# Altium schematic sheet tesis_page1_supply.SchDoc: Supply
size A4; Date: 01/04/2021; Author: Agustín Aon Sanchez; DrawnBy: Agustín Aon Sanchez; SheetNumber: 1; SheetTotal: 5
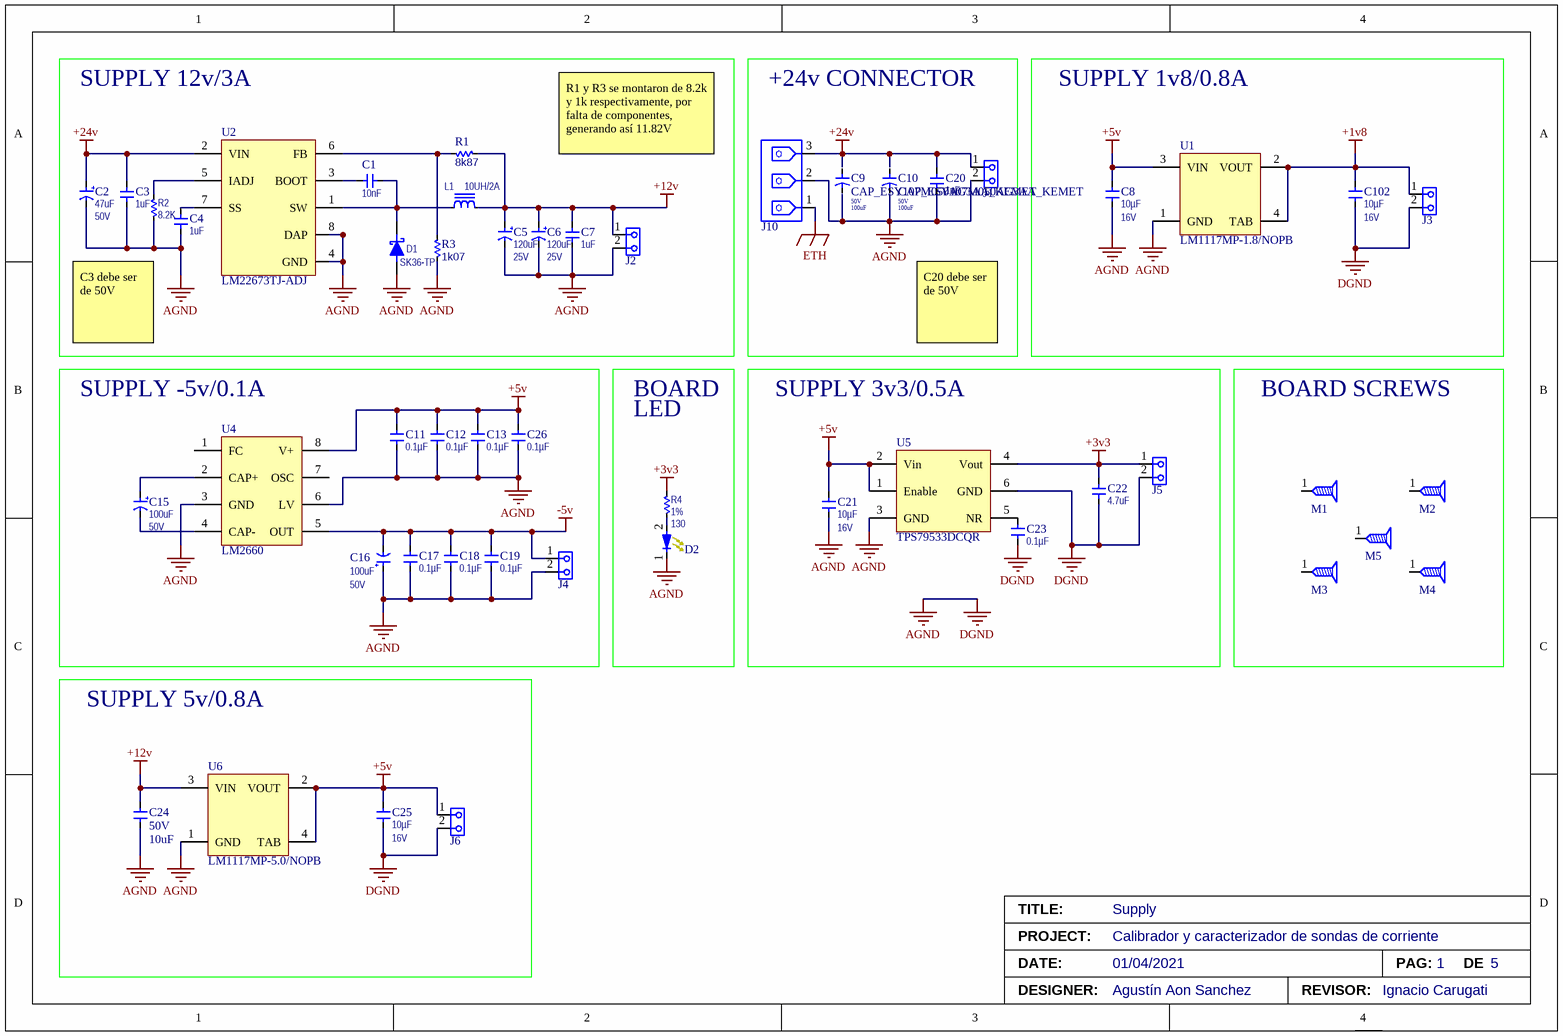
[diagram p0: tesis_page1_supply.SchDoc]

## Parts
C1  value 10nF  [CAPC3216X135N_B]  (hidden comment: CAP_C3216X7R2J103K115AA_TDK)
C2  value 47uF  Voltage Rating: 50V  [CAPAE630770X770N]  (hidden comment: CAP_EEE-1HA470XP_PANASONIC)
C3  value 1uF  [CAPC3216X135N_B]  (hidden comment: CAP_C3216X7R1E105M085AA_TDK)
C4  value 1uF  [CAPC3216X135N_B]  (hidden comment: CAP_C3216X7R1E105M085AA_TDK)
C5  value 120uF  Voltage Rating: 25V  [CAPPRD250W50D630H1250]  (hidden comment: CAP_ELXY250ELL121MF15D_UC)
C6  value 120uF  Voltage Rating: 25V  [CAPPRD250W50D630H1250]  (hidden comment: CAP_ELXY250ELL121MF15D_UC)
C7  value 1uF  [CAPC3216X135N_B]  (hidden comment: CAP_C3216X7R1E105M085AA_TDK)
C8  value 10µF  Voltage Rating: 16V  [CAPC2013X110N]  (hidden comment: CAP_CL21A106KOCL3RC)
C9  CAP_ESY107M050AG3AA_KEMET  Voltage: 50V  Capacitance: 100uF  [cap elec 8x11.5]
C10  CAP_ESY107M050AG3AA_KEMET  Voltage: 50V  Capacitance: 100uF  [cap elec 8x11.5]
C11  value 0.1µF  [CAPC2013X110N]  (hidden comment: CAP_CC0805KRX7R8BB104_YAGEO)
C12  value 0.1µF  [CAPC2013X110N]  (hidden comment: CAP_CC0805KRX7R8BB104_YAGEO)
C13  value 0.1µF  [CAPC2013X110N]  (hidden comment: CAP_CC0805KRX7R8BB104_YAGEO)
C15  value 100uF  Voltage Rating: 50V  [CAPPRD350W60D800H1200]  (hidden comment: CAP_   ESY107M050AG3AA_KEMET)
C16  value 100uF  Voltage Rating: 50V  [CAPPRD350W60D800H1200]  (hidden comment: CAP_   ESY107M050AG3AA_KEMET)
C17  value 0.1µF  [CAPC2013X110N]  (hidden comment: CAP_CC0805KRX7R8BB104_YAGEO)
C18  value 0.1µF  [CAPC2013X110N]  (hidden comment: CAP_CC0805KRX7R8BB104_YAGEO)
C19  value 0.1µF  [CAPC2013X110N]  (hidden comment: CAP_CC0805KRX7R8BB104_YAGEO)
C20  value 1uF  [CAPC3216X135N_B]
C21  value 10µF  Voltage Rating: 16V  [CAPC2013X110N]  (hidden comment: CAP_CL21A106KOCL3RC)
C22  value 4.7uF  [CAPC2013X110N]  (hidden comment: CAP_CC0805KKX5R8BB475_YAGEO_1)
C23  value 0.1µF  [CAPC2013X110N]  (hidden comment: CAP_CC0805KRX7R8BB104_YAGEO)
C24  value 10uF  Voltage Rating: 50V  [CAPC3216X135N_B]  (hidden comment: CAP_GRT31CR61H106ME01L)
C25  value 10µF  Voltage Rating: 16V  [CAPC2013X110N]  (hidden comment: CAP_CL21A106KOCL3RC)
C26  value 0.1µF  [CAPC2013X110N]  (hidden comment: CAP_CC0805KRX7R8BB104_YAGEO)
C102  value 10µF  Voltage Rating: 16V  [CAPC2013X110N]  (hidden comment: CAP_CL21A106KOCL3RC)
D1  SK36-TP  [DIOM7959X262N]
D2  DIO_150080YS75000_WURTH  [DIO0805]  (value not drawn)
J1  CON_Header_1x2  [RAD2]  (value not drawn)
J2  CON_Header_1x2  [RAD2]  (value not drawn)
J3  CON_Header_1x2  [RAD2]  (value not drawn)
J4  CON_Header_1x2  [RAD2]  (value not drawn)
J5  CON_Header_1x2  [RAD2]  (value not drawn)
J6  CON_Header_1x2  [RAD2]  (value not drawn)
J10  CON_691137710003  [CON_691137710003]  (value not drawn)
L1  value 10UH/2A  [MAG_INDUCTOR2A]  (hidden comment: MAG_SRR1005-100M_BOURNS)
M1  MSC_SCREW  [MH320]  (value not drawn)  (no BOM)
M2  MSC_SCREW  [MH320]  (value not drawn)  (no BOM)
M3  MSC_SCREW  [MH320]  (value not drawn)  (no BOM)
M4  MSC_SCREW  [MH320]  (value not drawn)  (no BOM)
M5  MSC_SCREW  [MH320]  (value not drawn)  (no BOM)
R1  value 8k87  [RESC2013X065BN]  (hidden comment: RES_RC0805FR-078K87L)
R2  value 8.2K  [RESC3216N]  (hidden comment: RES_ERJ-8GEYJ822V_Panasonic)
R3  value 1k07  [RESC2013X065BN]  (hidden comment: RES_RC0805FR-071K07L)
R4  value 130  Tolerance: 1%  [RESC2013X065BN]  (hidden comment: RES_RC0805FR-07130RL_YAGEO)
U1  LM1117MP-1.8/NOPB  [SOT223-3L]
U2  LM22673TJ-ADJ  [TJ7A_N]
U4  LM2660  [SOIC127P600-8BN]
U5  TPS79533DCQR  [SOT223-6L]
U6  LM1117MP-5.0/NOPB  [SOT223-3L]

## Blocks framed on the sheet
SUPPLY 12v/3A: C1-C7 D1 J2 L1 R1-R3 U2
+24v CONNECTOR: C9 C10 C20 J1 J10
SUPPLY 1v8/0.8A: C8 C102 J3 U1
SUPPLY -5v/0.1A: C11-C13 C15-C19 C26 J4 U4
SUPPLY 3v3/0.5A: C21-C23 J5 U5
BOARD SCREWS: M1-M5
SUPPLY 5v/0.8A: C24 C25 J6 U6

## Nets
+1v8: C102.1(T1) J3.1 U1.2(VOUT) U1.4(TAB)
+3v3: C22.1(T1) J5.1 R4.2(T2) U5.4(Vout)
+5v: C8.1(T1) C11.1(T1) C12.1(T1) C13.1(T1) C21.1(T1) C25.1(T1) C26.1(T1) J6.1 U1.3(VIN) U4.8(V+) U5.1(Enable) U5.2(Vin) U6.2(VOUT) U6.4(TAB)
+12v: C5.1 C6.1 C7.1(T1) C24.1(T1) J2.1 L1.2 R1.1(T1) U6.3(VIN)
+24v: C2.1 C3.1(T1) C20.1(T1) J1.1 J10.3 U2.2(VIN)
-5v: C16.2 C17.1(T1) C18.1(T1) C19.1(T1) J4.1 U4.5(OUT)
AGND: C2.2 C3.2(T2) C4.2(T2) C5.2 C6.2 C7.2(T2) C8.2(T2) C11.2(T2) C12.2(T2) C13.2(T2) C16.1 C17.2(T2) C18.2(T2) C19.2(T2) C20.2(T2) C21.2(T2) C22.2(T2) C23.2(T2) C24.2(T2) C25.2(T2) C26.2(T2) C102.2(T2) D1.2(A) D2.1(Cathode) J1.2 J2.2 J3.2 J4.2 J5.2 J6.2 J10.2 R2.1(T1) R3.1(T1) U1.1(GND) U2.4(GND) U2.8(DAP) U4.3(GND) U4.6(LV) U5.3(GND) U5.6(GND) U6.1(GND)  [also labelled DGND]
ETH: J10.1
NetC1_1: C1.1(T1) U2.3(BOOT)
NetC1_2: C1.2(T2) D1.1(K) L1.1 U2.1(SW)
NetC4_1: C4.1(T1) U2.7(SS)
NetC15_1: C15.1 U4.2(CAP+)
NetC15_2: C15.2 U4.4(CAP-)
NetC23_1: C23.1(T1) U5.5(NR)
NetD2_2: D2.2(Anode) R4.1(T1)
NetR1_2: R1.2(T2) R3.2(T2) U2.6(FB)
NetR2_2: R2.2(T2) U2.5(IADJ)

Not connected (* = marked no-connect by the designer): C9 24 25; C10 24 25; M1 1; M2 1; M3 1; M4 1; M5 1; U4 1(FC) 7(OSC)

## Notes on the sheet
- R1 y R3 se montaron de 8.2k y 1k respectivamente, por falta de componentes, generando así 11.82V
- C3 debe ser de 50V
- C20 debe ser de 50V
- BOARD
- LED
- TITLE:
- PROJECT:
- DATE:
- DESIGNER:
- Calibrador y caracterizador de sondas de corriente
- 01/04/2021
- Agustín Aon Sanchez
- REVISOR:
- Ignacio Carugati
- PAG:
- DE

## Library data of the parts
C1 = CAP_C3216X7R2J103K115AA_TDK: 10000pF, 630 V, Capacitores cerámicos, X7R, 1206 (3216 métrico), 0.126" L x 0.063" A (3.20 mm x 1.60 mm); Manufacturer: TDK; Tolerance: 10%; Voltage Rating: 630 V; Supplier: *; Supplier Part No: *; Power Rating: *; BOM Populate: *; Digikey Part Number: 445-2291-1-ND; Mouser Part Number: 810-C3216X7R2J103K; Manufacturer Part Number: C3216X7R2J103K115AA
C2 = CAP_EEE-1HA470XP_PANASONIC: 47µF 50V Aluminum Capacitors Radial, Can - SMD 2000 Hrs @ 85°C; Tolerance: 20%; BOM Populate: *; Power Rating: *; Supplier Part No: *; Supplier: *; Manufacturer: Panasonic; Petra Part No: *; Digikey Part Number: PCE3929CT-ND; Mouser Part Number: 667-EEE-1HA470XP; Manufacturer Part Number: EEE-1HA470XP
C3 C4 C7 C20 = CAP_C3216X7R1E105M085AA_TDK: 1 µF, 25 V, Capacitores cerámicos, X7R, 1206 (3216 métrico), 0.126" L x 0.063" A (3.20 mm x 1.60 mm); Manufacturer: TDK; Tolerance: 20%; Voltage Rating: 25V; Supplier: *; Supplier Part No: *; Power Rating: *; BOM Populate: *; Digikey Part Number: 445-4024-1-ND; Mouser Part Number: 810-C3216X7R1E105M-2; Manufacturer Part Number: C3216X7R1E105M085AA
C5 C6 = CAP_ELXY250ELL121MF15D_UC: CAP ALUM 120UF 20% 25V RADIAL; BOM Populate: *; Power Rating: *; Supplier Part No: *; Supplier: *; Digikey Part Number: 565-1791-ND; Tolerance: 20%; Petra Part No: *; Mouser Part Number: 661-ELXY250ELL121MF1; Manufacturer Part Number: ELXY250ELL121MF15D
C8 C21 C25 C102 = CAP_CL21A106KOCL3RC: CAP CER 10UF 16V X5R 0805; Manufacturer: Samsung; Tolerance: 10%; Manufacturer Part Number: CL21A106KOCL3RC; Supplier 1: Future Electronics; RoHS: Yes; Category: Ceramic Capacitors; Stock 1: 3934; Pricing 1: 1=0,10400, 50=0,08230, 100=0,07900, 500=0,07190, 1500=0,06740 (USD); Mount: Surface Mount; Case/Package: 0805; Case Code (Metric): 2012; Case Code (Imperial): 0805; Min Operating Temperature: -55°C; Max Operating Temperature: 85°C; Package Quantity: 1; Packaging: Tape and Reel; Length: 0.079inch; Width: 0.049inch; Thickness: 0.037inch; ComponentLink1URL: https://datasheet.ciiva.com/25796/cl21a106kocl3rc-25796224.pdf?src-supplier=Digi-Key; ComponentLink1Description: https://datasheet.ciiva.com/25796/cl21a106kocl3rc-25796224.pdf?src-supplier=Digi-Key; Supplier Part Number 1: 8109145; Capacitance: 10µF
C9 C10 = CAP_ESY107M050AG3AA_KEMET: KEMET - ESY107M050AG3AA - Elektrolytkondensator, 100 µF, 50 V, Produktreihe ESY, ± 20%, Radial bedrahtet, 8 mm; Dielectric Material: Aluminium; Ripple Current: 511mA; Life (Hours): 3000Hour; Leakage Current: 50uA; Dissipation Factor: 0.1%; Lead/Base Style: Straight; Impedance: 74mR; Lead Diameter: 0.6mm; Lead Length: 20mm; Tolerance: 20%; Voltage Rating: 50V; Supplier 1: Digi-Key; Manufacturer 1: KEMET; Manufacturer Part Number 1: ESY107M050AG3AA; Stock 1: 587; Pricing 1: 1=0,44000, 10=0,30700, 50=0,21500, 100=0,18420, 500=0,13818, 1000=0,11668, 2500=0,11054, 5000=0,10440 (USD); RoHS: Yes; Mount: Through Hole,PCB; Case/Package: Radial; Min Operating Temperature: -40°C; Max Operating Temperature: 105°C; Termination: Radial; Packaging: Bulk; Voltage Rating (DC): 50V; Package Quantity: 6000; Series: ESY; ESR (Equivalent Series Resistance): 74mR; Diameter: 8mm; Length: 11mm; Height: 11mm; Lead Pitch: 3.5mm; Height - Seated (Max): 0.492inch; Radiation Hardening: No; RoHS Compliant: Yes; ComponentLink1URL: http://www.farnell.com/datasheets/2751412.pdf?src-supplier=Farnell; ComponentLink1Description: http://www.farnell.com/datasheets/2751412.pdf?src-supplier=Farnell; ComponentLink2URL: http://www.mouser.com/ds/2/212/KEM_A4007_ESY-1103537.pdf?src-supplier=Mouser; ComponentLink2Description: http://www.mouser.com/ds/2/212/KEM_A4007_ESY-1103537.pdf?src-supplier=Mouser; ComponentLink3URL: http://components.arrow.com/part/dataview/0323_06946698?src-supplier=Arrow+Europe; ComponentLink3Description: http://components.arrow.com/part/dataview/0323_06946698?src-supplier=Arrow+Europe; ComponentLink4URL: https://www.alliedelec.com/m/d/2f7883d23207e2a46fd2b27bea013c02.pdf?src-supplier=Allied+Electronics; ComponentLink4Description: https://www.alliedelec.com/m/d/2f7883d23207e2a46fd2b27bea013c02.pdf?src-supplier=Allied+Electronics; ComponentLink5URL: http://uk.rs-online.com/webdocs/13da/0900766b813da6ab.pdf?src-supplier=RSComponents; ComponentLink5Description: http://uk.rs-online.com/webdocs/13da/0900766b813da6ab.pdf?src-supplier=RSComponents; ComponentLink6URL: https://api.kemet.com/component-edge/download/specsheet/ESY107M050AG3AA.pdf?src-supplier=Digi-Key; ComponentLink6Description: https://api.kemet.com/component-edge/download/specsheet/ESY107M050AG3AA.pdf?src-supplier=Digi-Key; ComponentLink7URL: http://capacitoredge.kemet.com/capedge2/DataSheet?pn=ESY107M050AG3AA&src-supplier=Avnet; ComponentLink7Description: http://capacitoredge.kemet.com/capedge2/DataSheet?pn=ESY107M050AG3AA&src-supplier=Avnet; ComponentLink8URL: http://capacitoredge.kemet.com/capedge2/DataSheet/Datasheet-ESY107M050AG3AA.pdf?pn=ESY107M050AG3AA&src-supplier=Onlinecomponents.com; ComponentLink8Description: http://capacitoredge.kemet.com/capedge2/DataSheet/Datasheet-ESY107M050AG3AA.pdf?pn=ESY107M050AG3AA&src-supplier=Onlinecomponents.com; ComponentLink9URL: http://capacitoredge.kemet.com/capedge2/DataSheet?pn=ESY107M050AG3AA&src-supplier=Avnet+Europe; ComponentLink9Description: http://capacitoredge.kemet.com/capedge2/DataSheet?pn=ESY107M050AG3AA&src-supplier=Avnet+Europe; ComponentLink10URL: http://www.farnell.com/datasheets/2751412.pdf?src-supplier=Newark; ComponentLink10Description: http://www.farnell.com/datasheets/2751412.pdf?src-supplier=Newark; Supplier Part Number 1: 399-6119-ND
C11-C13 C17-C19 C23 C26 = CAP_CC0805KRX7R8BB104_YAGEO: CAP CER 0.1UF 25V 10% X7R 0805; Manufacturer: Yageo; Digikey Part Number: 311-1141-1-ND; Supplier: *; Tolerance: 10%; Power Rating: *; Voltage Rating: 25V; BOM Populate: *; Mouser Part Number: 603-CC805KRX7R8BB104; Manufacturer Part Number: CC0805KRX7R8BB104
C15 C16 = CAP_   ESY107M050AG3AA_KEMET: CAP ALUM 100UF 20% 50V RADIAL; BOM Populate: *; Power Rating: *; Supplier Part No: *; Supplier: *; Digikey Part Number: 399-6119-ND; Tolerance: 20%; Petra Part No: *; Mouser Part Number: 80-ESY107M050AG3AA; Manufacturer Part Number: ESY107M050AG3AA
C22 = CAP_CC0805KKX5R8BB475_YAGEO_1: CAP CER 4.7UF 25V X5R 0805; Manufacturer: YAGEO; Tolerance: 10%; Voltage Rating: 25V; Digikey Part Number: 311-1904-1-ND; Mouser Part Number: 603-CC805KKX5R8BB475; Manufacturer Part Number: CC0805KKX5R8BB475
C24 = CAP_GRT31CR61H106ME01L: Cap Ceramic 10uF 50V X5R 20% Pad SMD 1206 85C Automotive T/R; Manufacturer: Murata; Tolerance: 20%; Manufacturer Part Number: GRT31CR61H106ME01L; Supplier 1: Digi-Key; RoHS: Yes; Category: Ceramic Capacitors; Stock 1: 575627; Pricing 1: 1=0,46000, 10=0,31800, 50=0,22240, 100=0,19060, 500=0,14294, 1000=0,12070 (USD); Mount: Surface Mount; Case/Package: 1206; Case Code (Metric): 3216; Case Code (Imperial): 1206; Min Operating Temperature: -55°C; Max Operating Temperature: 85°C; Packaging: Tape and Reel; Length: 0.126inch; Width: 0.063inch; Thickness: 0.071inch; ComponentLink1URL: http://search.murata.co.jp/Ceramy/image/img/A01X/G101/ENG/GRT31CR61H106ME01-01.pdf?src-supplier=Digi-Key; ComponentLink1Description: http://search.murata.co.jp/Ceramy/image/img/A01X/G101/ENG/GRT31CR61H106ME01-01.pdf?src-supplier=Digi-Key; Supplier Part Number 1: 490-12457-1-ND; Ratings: AEC-Q200; RoHS Compliant: Yes
D1 = DIO_SK36_MICROCOM: DIODE SCHOTTKY 60V 3A SMC; Manufacturer: Micro Commercial Co; Digikey Part Number: SK36-TPMSCT-ND; Manufacturer Part Number: SK36-TP; Mouser Part Number: 833-SK36-TP
D2 = DIO_150080YS75000_WURTH: LED YELLOW CLEAR 0805 SMD; Manufacturer: Wurth Electronics Inc.; Manufacturer Part Number: 150080YS75000; Digikey Part Number: 732-4987-1-ND; Mouser Part Number: 710-150080YS75000
J10 = CON_691137710003: TERM BLK 3POS SIDE ENTRY 5MM PCB; Manufacturer: Wurth Electronics; Supplier 1: Digi-Key; Supplier Part Number 1: 732-10956-ND; Manufacturer Part Number: 691137710003; RoHS: No; Stock 1: 910; Pricing 1: 1=0,62000, 10=0,55000, 50=0,49000, 100=0,44000, 500=0,42000 (USD); ComponentLink1URL: https://katalog.we-online.de/em/datasheet/691137710003.pdf?src-supplier=Digi-Key; ComponentLink1Description: https://katalog.we-online.de/em/datasheet/691137710003.pdf?src-supplier=Digi-Key
L1 = MAG_SRR1005-100M_BOURNS: FIXED IND 10UH 2A 65 MOHM SMD; Manufacturer: Bourns Inc; BOM Populate: *; Current Rating: *; Supplier: *; Supplier Part No: *; Voltage Rating: *; Tolerance: *; Digikey Part Number: SRR1005-100MCT-ND; Manufacturer Part Number: SRR1005-100M; Mouser Part Number: 652-SRR1005-100M
M1-M5 = MSC_SCREW: SCREW; BOM Populate: *; Tolerance: *; Power Rating: *; Voltage Rating: *
R1 = RES_RC0805FR-078K87L: Res Thick Film 0805 8.87K Ohm 1% 0.125W(1/8W) ±100ppm/C Epoxy Pad SMD T/R; Manufacturer: Yageo; Temperature Coefficient: 100ppm/°C; Power Rating: 125mW; Voltage Rating: 150V; Supplier 1: Digi-Key; Supplier Part Number 1: 311-8.87KCRCT-ND; Manufacturer Part Number: RC0805FR-078K87L; Category: Chip SMD Resistors; Case/Package: 0805; Contact Plating: Tin,Lead,Matte; Case Code (Metric): 2012; Case Code (Imperial): 0805; Size Code: 0805; Min Operating Temperature: -55°C; Max Operating Temperature: 155°C; Tolerance: 1%; Resistor Type: Thick Film; Package Quantity: 1; Packaging: Tape and Reel; Number of Terminations: 2; Termination: SMD/SMT; Max Power Dissipation: 125mW; Voltage Rating (DC): 150V; Features: Moisture Resistant; Series: RC; Construction: Rectangular; Length: 2mm; Width: 0.049inch; Height: 0.024inch; Depth: 1.25mm; Radiation Hardening: No; Military Standard: Not; Lead Free: Lead Free; RoHS Compliant: Yes; ComponentLink1URL: https://datasheet.ciiva.com/17423/rc0805-17423031.pdf?src-supplier=Future+Electronics; ComponentLink1Description: https://datasheet.ciiva.com/17423/rc0805-17423031.pdf?src-supplier=Future+Electronics; ComponentLink2URL: https://datasheet.ciiva.com/2491/pyu-r-int-thick-7-2491576.pdf?src-supplier=Digi-Key; ComponentLink2Description: https://datasheet.ciiva.com/2491/pyu-r-int-thick-7-2491576.pdf?src-supplier=Digi-Key; ComponentLink3URL: https://datasheet.ciiva.com/2491/pyu-r-int-thick-7-2491577.pdf?src-supplier=Digi-Key; ComponentLink3Description: https://datasheet.ciiva.com/2491/pyu-r-int-thick-7-2491577.pdf?src-supplier=Digi-Key; ComponentLink4URL: https://datasheet.ciiva.com/2491/pyu-r-int-thick-7-2491578.pdf?src-supplier=Digi-Key; ComponentLink4Description: https://datasheet.ciiva.com/2491/pyu-r-int-thick-7-2491578.pdf?src-supplier=Digi-Key
R2 = RES_ERJ-8GEYJ822V_Panasonic: RES SMD 8.2K OHM 5% 1/4W 1206; BOM Populate: *; Supplier Part No: *; Supplier: *; Tolerance: 5%; Manufacturer: Panasonic; Digikey Part Number: P8.2KECT-ND; Power Rating: 1/4W; Manufacturer Part Number: ERJ-8GEYJ822V; Mouser Part Number: 667-ERJ-8GEYJ822V
R3 = RES_RC0805FR-071K07L: Res Thick Film 0805 1.07K Ohm 1% 1/8W 100ppm/C Molded SMD Paper T/R; Manufacturer: Yageo; Resistance: 1.07kR; Temperature Coefficient: 100ppm/°C; Power Rating: 125mW; Voltage Rating: 150V; Supplier 1: Digi-Key; Manufacturer Part Number: RC0805FR-071K07L; RoHS: Yes; Category: Chip SMD Resistors; Stock 1: 47079; Pricing 1: 1=0,10000, 10=0,04000, 100=0,01620, 1000=0,00726, 2500=0,00630 (USD); Case/Package: 0805; Contact Plating: Tin,Matte; Case Code (Imperial): 0805; Case Code (Metric): 2012; Size Code: 0805; Min Operating Temperature: -55°C; Max Operating Temperature: 155°C; Tolerance: 1%; Resistor Type: Thick Film; Packaging: Tape and Reel; Package Quantity: 1; Termination: SMD/SMT; Number of Terminations: 2; Max Power Dissipation: 125mW; Voltage Rating (DC): 150V; Features: Moisture Resistant; Series: RC; Construction: Rectangular; Length: 2mm; Width: 1.25mm; Height: 0.024inch; Depth: 1.25mm; Military Standard: Not; Lead Free: Lead Free; RoHS Compliant: Yes; ComponentLink1URL: https://datasheet.ciiva.com/17054/rc0805-17054582.pdf?src-supplier=Future+Electronics; ComponentLink1Description: https://datasheet.ciiva.com/17054/rc0805-17054582.pdf?src-supplier=Future+Electronics; ComponentLink2URL: https://datasheet.ciiva.com/2491/pyu-r-int-thick-7-2491690.pdf?src-supplier=Digi-Key; ComponentLink2Description: https://datasheet.ciiva.com/2491/pyu-r-int-thick-7-2491690.pdf?src-supplier=Digi-Key; ComponentLink3URL: https://datasheet.ciiva.com/2491/pyu-r-int-thick-7-2491691.pdf?src-supplier=Digi-Key; ComponentLink3Description: https://datasheet.ciiva.com/2491/pyu-r-int-thick-7-2491691.pdf?src-supplier=Digi-Key; ComponentLink4URL: https://datasheet.ciiva.com/2491/pyu-r-int-thick-7-2491692.pdf?src-supplier=Digi-Key; ComponentLink4Description: https://datasheet.ciiva.com/2491/pyu-r-int-thick-7-2491692.pdf?src-supplier=Digi-Key; Supplier Part Number 1: 311-1.07KCRCT-ND
R4 = RES_RC0805FR-07130RL_YAGEO: RES SMD 130 OHM 1% 1/8W 0805; Manufacturer: Yageo; BOM Populate: *; Supplier Part No: *; Supplier: *; Digikey Part Number: 311-130CRCT-ND; Power Rating: 1/8W; Manufacturer Part Number: RC0805FR-07130RL; Mouser Part Number: 603-RC0805FR-07130RL
U1 = IC_LM1117MP-1.8/NOPB: IC REG LDO 1.8V .8A SOT-223-4; Manufacturer: TI National Semiconductor; Number of Terminals/Pins: 4; Number of Outputs: 1; Max Input Voltage: 15V; Max Output Current: 800mA; Polarity: Positive; Quiescent Current: 10mA; Accuracy: 1%; Output Type: Fixed; Dropout Voltage: 1.2V; Min Input Voltage: 2.6V; Current Rating: 800A; Supplier 1: Digi-Key; Manufacturer Part Number: LM1117MP-1.8/NOPB; RoHS: Yes; Category: Voltage Regulators - Linear; Stock 1: 6695; Pricing 1: 1=1,10000, 10=0,98500, 25=0,93520, 100=0,71810, 250=0,63460, 500=0,60120 (USD); Mount: Surface Mount; Case/Package: SOT-223; Number of Pins: 4; Min Operating Temperature: 0°C; Max Operating Temperature: 125°C; Output Voltage: 1.8V; Output Current: 800mA; Packaging: Tape and Reel; Nominal Output Voltage: 1.8V; Output Voltage Accuracy: 1%; Package Quantity: 1000; Length: 6.5mm; Width: 3.56mm; Height: 1.6mm; Radiation Hardening: No; REACH SVHC: No SVHC; Lead Free: Lead Free; Supplier Part Number 1: LM1117MP-1.8/NOPBCT-ND
U2 = IC_LM22673TJ-ADJ: 3A SIMPLE SWITCHER® Step-Down Voltage Regulator with Adjustable Soft-Start and Current Limit, 7-pin TO-263 Thin; Manufacturer Part Number: LM22673TJ-ADJ/NOPB; Digikey Part Number: LM22673TJ-ADJ/NOPBCT-ND; Mouser Part Number: 926-LM22673TJADJNOPB
U4 = IC_LM2660MX/NOPB_1: IC REG SWTCHD CAP INV 0.1A 8SOIC; Digikey Part Number: LM2660MX/NOPBCT-ND; Manufacturer Part Number: LM2660MX/NOPB; Mouser Part Number: 926-LM2660MX/NOPB
U5 = IC_TPS79533DCQR_TI: IC REG LIN 3.3V 500MA SOT223-6; Manufacturer Part Number: 595-TPS79533DCQR; Digikey Part Number: 296-13810-1-ND; Mouser Part Number: TPS79533DCQR
U6 = IC_LM1117MP-5.0/NOPB: IC REG LDO 5V .8A SOT-223-4; Manufacturer: TI National Semiconductor; Number of Outputs: 1; Max Input Voltage: 15V; Max Output Current: 800mA; Polarity: Positive; Quiescent Current: 5mA; Accuracy: 1%; Output Type: Fixed; Dropout Voltage: 1.2V; Min Input Voltage: 2.6V; Current Rating: 800A; Max Supply Voltage: 12V; Max Supply Current: 10mA; Power Supply Rejection Ratio (PSRR): 75dB; Supplier 1: Digi-Key; Manufacturer Part Number: LM1117MP-5.0/NOPB; RoHS: Yes; Category: Voltage Regulators - Linear; Stock 1: 1093; Pricing 1: 1=1,17000, 10=1,04400, 25=0,99120, 100=0,76120, 250=0,67268, 500=0,63728 (USD); Mount: Surface Mount; Case/Package: SOT-223; Number of Pins: 4; Min Operating Temperature: 0°C; Max Operating Temperature: 125°C; Output Voltage: 5V; Output Current: 800mA; Packaging: Tape and Reel; Nominal Output Voltage: 5V; Output Voltage Accuracy: 1%; Package Quantity: 1000; Length: 6.5mm; Width: 3.56mm; Height: 1.6mm; Radiation Hardening: No; REACH SVHC: No SVHC; Lead Free: Lead Free; Supplier Part Number 1: LM1117MP-5.0/NOPBCT-ND; Contact Plating: Tin,Matte; Number of Regulators: 1; Min Current Limit: 800mA; Series: -; Output Configuration: Positive; RoHS Compliant: Yes